# EAGLE schematic power_converter (EAGLE 9.0.0)
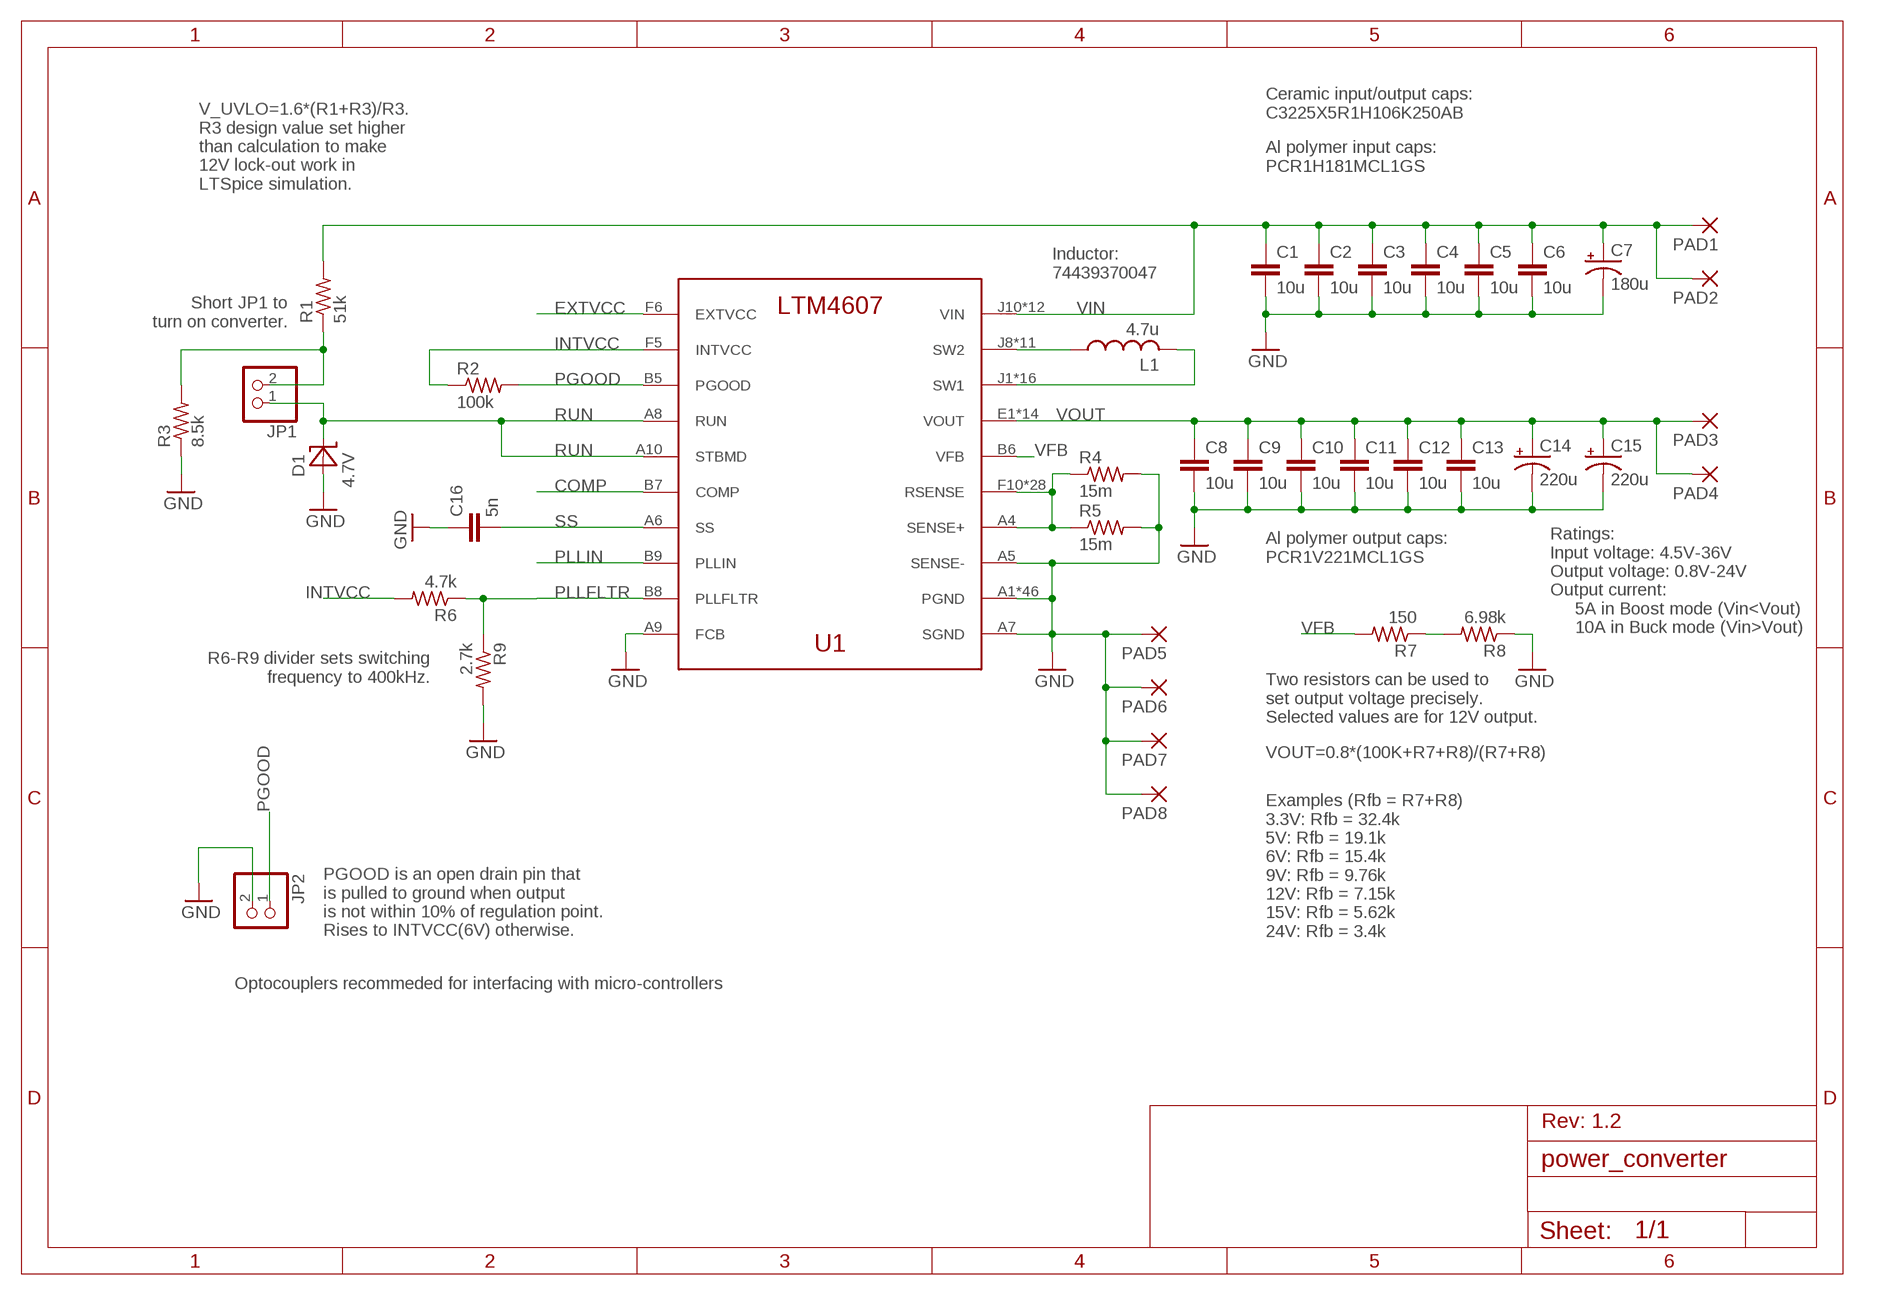
[diagram p0: schematic, sheet 1]

## Parts
C1  10u  C-EUC1210  [C1210]
C2  10u  C-EUC1210  [C1210]
C3  10u  C-EUC1210  [C1210]
C4  10u  C-EUC1210  [C1210]
C5  10u  C-EUC1210  [C1210]
C6  10u  C-EUC1210  [C1210]
C7  180u  PCR1H181MCL1GS  [PCR1H181MCL1GS]
C8  10u  C-EUC1210  [C1210]
C9  10u  C-EUC1210  [C1210]
C10  10u  C-EUC1210  [C1210]
C11  10u  C-EUC1210  [C1210]
C12  10u  C-EUC1210  [C1210]
C13  10u  C-EUC1210  [C1210]
C14  220u  PCR1V221MCL1GS  [PCR1V221MCL1GS]
C15  220u  PCR1V221MCL1GS  [PCR1V221MCL1GS]
C16  5n  C-EUC0603  [C0603]
D1  4.7V  BZX84C4V7LT1G  [SOT23]
JP1  PINHD-1X02_2.54-SMD  [1X02SMD]
JP2  PINHD-1X02_2.54-SMD  [1X02SMD]
L1  4.7u  74439370047  [74439370047]
PAD1  3,81/1,5  [3,81/1,5]
PAD2  3,81/1,5  [3,81/1,5]
PAD3  3,81/1,5  [3,81/1,5]
PAD4  3,81/1,5  [3,81/1,5]
PAD5  3,81/1,5  [3,81/1,5]
PAD6  3,81/1,5  [3,81/1,5]
PAD7  3,81/1,5  [3,81/1,5]
PAD8  3,81/1,5  [3,81/1,5]
R1  51k  R-US_R0603  [R0603]
R2  100k  R-US_R0603  [R0603]
R3  8.5k  R-US_R0603  [R0603]
R4  15m  R-US_R1206  [R1206]
R5  15m  R-US_R1206  [R1206]
R6  4.7k  R-US_R0603  [R0603]
R7  150  R-US_R0603  [R0603]
R8  6.98k  R-US_R0603  [R0603]
R9  2.7k  R-US_R0603  [R0603]
U1  LTM4607EVPBF  [LGA-141]

## Nets
COMP: U1.B7(COMP)
EXTVCC: U1.F6(EXTVCC)
GND: C1.2 C2.2 C3.2 C4.2 C5.2 C6.2 C7.NEG(-) C8.2 C9.2 C10.2 C11.2 C12.2 C13.2 C14.NEG(-) C15.NEG(-) C16.1 D1.1(A) JP2.2 PAD5.1(P) PAD6.1(P) PAD7.1(P) PAD8.1(P) R3.1 R4.2 R5.2 R8.1 R9.2 U1.A1(PGND) U1.A2(PGND) U1.A3(PGND) U1.A5(SENSE-) U1.A7(SGND) U1.A9(FCB) U1.A11(PGND) U1.A12(PGND) U1.B1(PGND) U1.B2(PGND) U1.B3(PGND) U1.B4(PGND) U1.B10(PGND) U1.B11(PGND) U1.B12(PGND) U1.C1(PGND) U1.C2(PGND) U1.C3(PGND) U1.C4(PGND) U1.C5(PGND) U1.C6(PGND) U1.C7(PGND) U1.C8(PGND) U1.C9(PGND) U1.C10(PGND) U1.C11(PGND) U1.C12(PGND) U1.D1(PGND) U1.D2(PGND) U1.D3(PGND) U1.D4(PGND) U1.D5(PGND) U1.D6(PGND) U1.D7(PGND) U1.D8(PGND) U1.D9(PGND) U1.D10(PGND) U1.D11(PGND) U1.D12(PGND) U1.E3(PGND) U1.E4(PGND) U1.E5(PGND) U1.E6(PGND) U1.E7(PGND) U1.E8(PGND) U1.E9(PGND) U1.E10(PGND) U1.E11(PGND) U1.E12(PGND)
INTVCC: R2.1 R6.2 U1.F5(INTVCC)
N$1: R7.1 R8.2
N$2: JP1.2 R1.1 R3.2
PGOOD: JP2.1 R2.2 U1.B5(PGOOD)
PLLFLTR: R6.1 R9.1 U1.B8(PLLFLTR)
PLLIN: U1.B9(PLLIN)
RSENSE: R4.1 R5.1 U1.A4(SENSE+) U1.F10(RSENSE) U1.F11(RSENSE) U1.F12(RSENSE) U1.G5(RSENSE) U1.G6(RSENSE) U1.G7(RSENSE) U1.G8(RSENSE) U1.G9(RSENSE) U1.G10(RSENSE) U1.G11(RSENSE) U1.G12(RSENSE) U1.H5(RSENSE) U1.H6(RSENSE) U1.H7(RSENSE) U1.H8(RSENSE) U1.H9(RSENSE) U1.H10(RSENSE) U1.H11(RSENSE) U1.H12(RSENSE) U1.J5(RSENSE) U1.J6(RSENSE) U1.J7(RSENSE) U1.K5(RSENSE) U1.K6(RSENSE) U1.L5(RSENSE) U1.L6(RSENSE) U1.M5(RSENSE) U1.M6(RSENSE)
RUN: D1.3(C) JP1.1 U1.A8(RUN) U1.A10(STBMD)
SS: C16.2 U1.A6(SS)
SW1: L1.M2 U1.J1(SW1) U1.J2(SW1) U1.J3(SW1) U1.J4(SW1) U1.K1(SW1) U1.K2(SW1) U1.K3(SW1) U1.K4(SW1) U1.L1(SW1) U1.L2(SW1) U1.L3(SW1) U1.L4(SW1) U1.M1(SW1) U1.M2(SW1) U1.M3(SW1) U1.M4(SW1)
SW2: L1.M1 U1.J8(SW2) U1.J9(SW2) U1.K7(SW2) U1.K8(SW2) U1.K9(SW2) U1.L7(SW2) U1.L8(SW2) U1.L9(SW2) U1.M7(SW2) U1.M8(SW2) U1.M9(SW2)
VFB: R7.2 U1.B6(VFB)
VIN: C1.1 C2.1 C3.1 C4.1 C5.1 C6.1 C7.POS(+) PAD1.1(P) PAD2.1(P) R1.2 U1.J10(VIN) U1.J11(VIN) U1.J12(VIN) U1.K10(VIN) U1.K11(VIN) U1.K12(VIN) U1.L10(VIN) U1.L11(VIN) U1.L12(VIN) U1.M10(VIN) U1.M11(VIN) U1.M12(VIN)
VOUT: C8.1 C9.1 C10.1 C11.1 C12.1 C13.1 C14.POS(+) C15.POS(+) PAD3.1(P) PAD4.1(P) U1.E1(VOUT) U1.E2(VOUT) U1.F1(VOUT) U1.F2(VOUT) U1.F3(VOUT) U1.F4(VOUT) U1.G1(VOUT) U1.G2(VOUT) U1.G3(VOUT) U1.G4(VOUT) U1.H1(VOUT) U1.H2(VOUT) U1.H3(VOUT) U1.H4(VOUT)

## Notes on the sheet
- Ceramic input/output caps:
  C3225X5R1H106K250AB
- Al polymer input caps:
  PCR1H181MCL1GS
- V_UVLO=1.6*(R1+R3)/R3.
  R3 design value set higher 
  than calculation to make
  12V lock-out work in
  LTSpice simulation.
- Inductor:
  74439370047
- Short JP1 to
  turn on converter.
- Ratings:
  Input voltage: 4.5V-36V
  Output voltage: 0.8V-24V
  Output current:
       5A in Boost mode (Vin<Vout)
       10A in Buck mode (Vin>Vout)
- Al polymer output caps:
  PCR1V221MCL1GS
- R6-R9 divider sets switching
  frequency to 400kHz.
- Two resistors can be used to
  set output voltage precisely.
  Selected values are for 12V output.
- VOUT=0.8*(100K+R7+R8)/(R7+R8)
- Examples (Rfb = R7+R8)
  3.3V: Rfb = 32.4k
  5V: Rfb = 19.1k
  6V: Rfb = 15.4k
  9V: Rfb = 9.76k
  12V: Rfb = 7.15k
  15V: Rfb = 5.62k
  24V: Rfb = 3.4k
- PGOOD is an open drain pin that
  is pulled to ground when output
  is not within 10% of regulation point.
  Rises to INTVCC(6V) otherwise.
- Optocouplers recommeded for interfacing with micro-controllers
- Rev: 1.2

## Library data of the parts
C1-C6 C8-C13 C16 = rcl:C-EU: CAPACITOR, European symbol; SPICEPREFIX: C
C7 = LTM4607:PCR1H181MCL1GS
C14 C15 = LTM4607:PCR1V221MCL1GS
D1 = LTM4607:BZX84C4V7LT1G
JP1 JP2 = pinhead-2:PINHD-1X02: PIN HEADER
L1 = LTM4607:74439370047
PAD1-PAD8 = LTM4607:3,81/1,5: THROUGH-HOLE PAD
R1-R9 = rcl:R-US_: RESISTOR, American symbol; SPICEPREFIX: R
U1 = LTM4607:LTM4607EVPBF; MANUFACTURER_PART_NUMBER: LTM4607EV#PBF; VENDOR: Linear Technology